# EAGLE design 5v power supply (EAGLE 9.6.2)
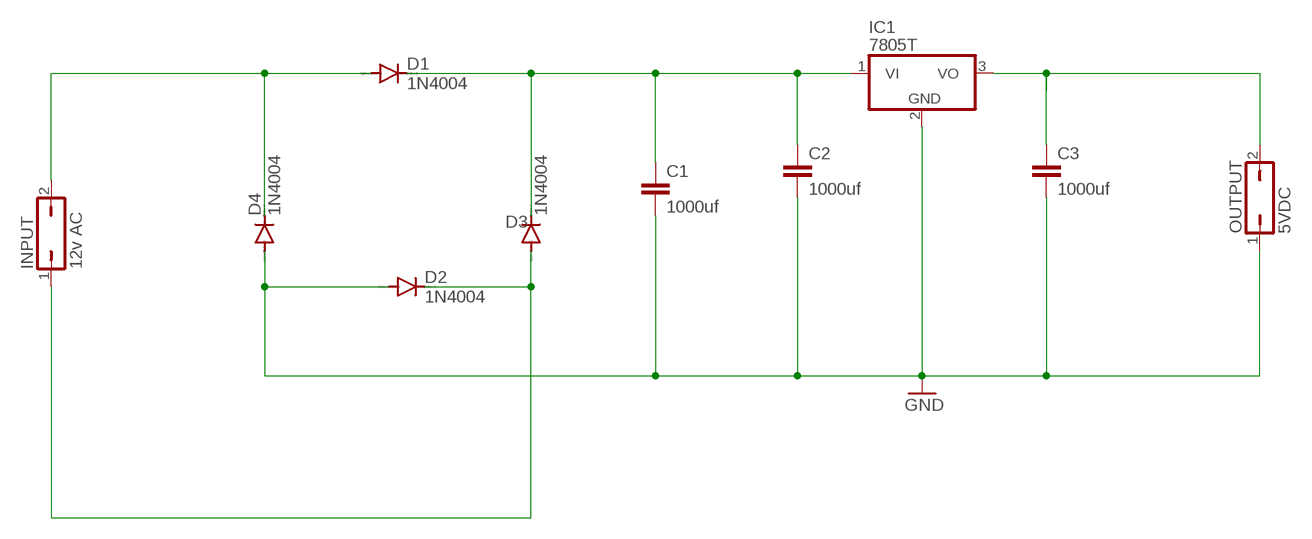
[diagram p0: schematic, sheet 1]

## Parts
C1  1000uf  C2,5-3  [C2.5-3]
C2  1000uf  C2,5-3  [C2.5-3]
C3  1000uf  C2,5-3  [C2.5-3]
D1  1N4004  [DO41-10]
D2  1N4004  [DO41-10]
D3  1N4004  [DO41-10]
D4  1N4004  [DO41-10]
IC1  7805T  [TO220H]
INPUT  12v AC  JP1Q  [JP1]
OUTPUT  5VDC  JP1Q  [JP1]

## Nets
GND: C1.2 C2.2 C3.2 D2.A D4.A IC1.2(GND) OUTPUT.1
N$1: D1.A D4.C INPUT.2
N$2: C1.1 C2.1 D1.C D3.C IC1.1(VI)
N$3: C3.1 IC1.3(VO) OUTPUT.2
N$4: D2.C D3.A INPUT.1

## Library data of the parts
C1-C3 = capacitor-wima:C: CAPACITOR naming: grid - package width
D1-D4 = diode:1N4004: DIODE general purpose rectifier, 1 A
IC1 = linear:78*: Positive VOLTAGE REGULATOR Source: http://cache.national.com/ds/LM/LM78L05.pdf http://www.fairchildsemi.com/ds/LM/LM7805.pdf
INPUT OUTPUT = jumper:JP1Q: JUMPER

## Board
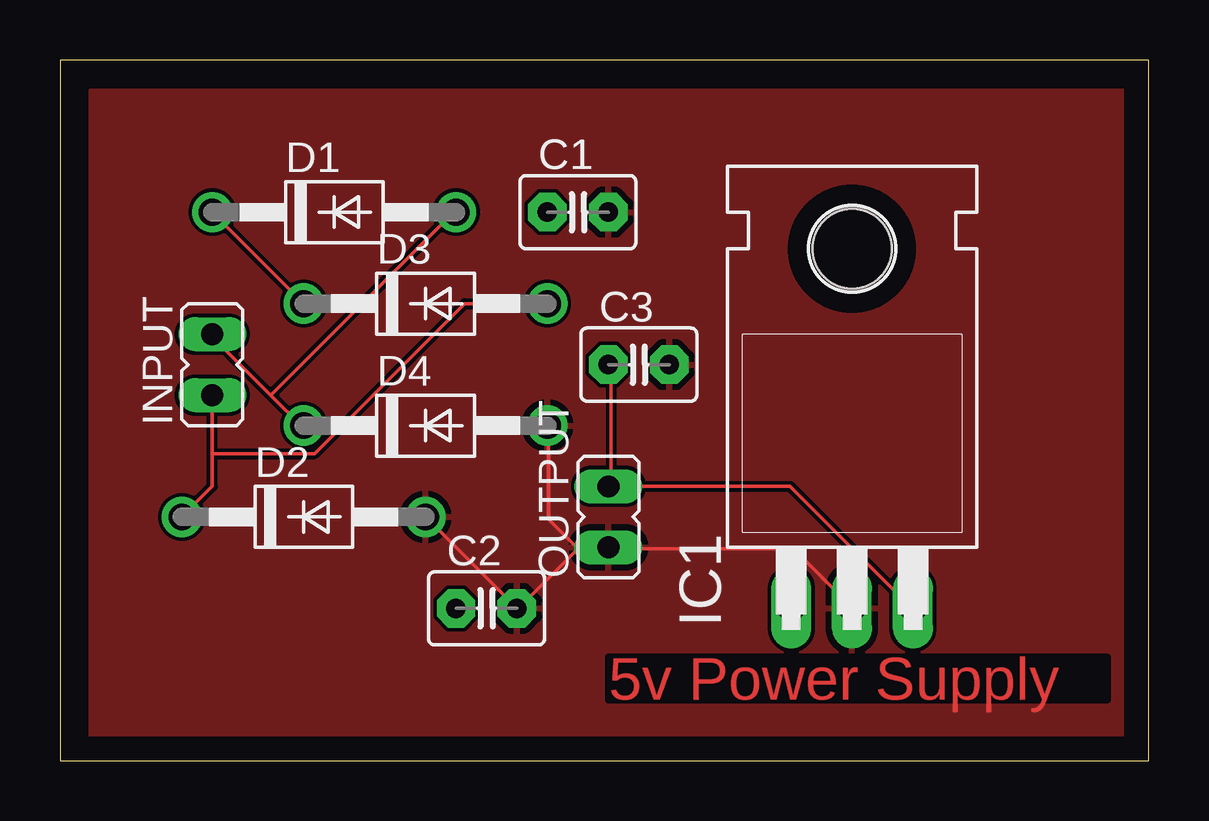
[diagram p1: board, top side]
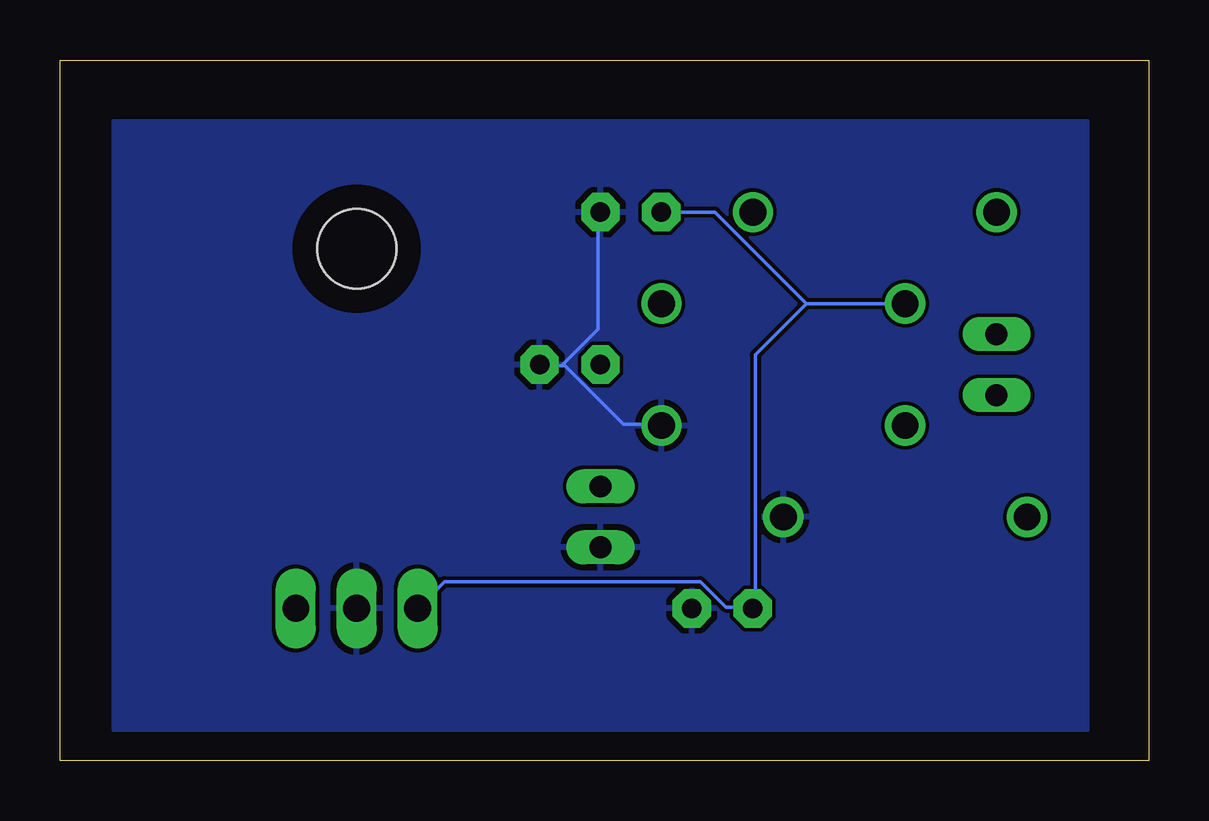
[diagram p2: board, bottom side, seen from below]

Size 45.39 x 29.2 mm. Coordinates in mm from the lower left corner, seen from the top.
Outline: 0,0 45.39,0 45.39,29.2 0,29.2 0,0
Copper layers (1*16): Top 0.035mm / dielectric 1.5mm / Bottom 0.035mm
Design rules "default": minimum track width 6mil, minimum drill 0.35mm, track to track 6mil, track to pad 6mil, pad to pad 6mil, via to via 6mil, smd to smd 6mil, copper to edge 40mil, drill to drill 6mil, minimum pad ring 10mil, minimum via ring 8mil, stop-mask expansion 4mil, vias tented up to drill 0mil, thermal gap 10mil

### Footprints (pad centres in the part's own frame; a part is rotated, then mirrored left to right if it is on the bottom)
C2.5-3 = drill 0.813 pad 1.6 octagon: 1 -1.27,0; 2 1.27,0
DO41-10 = drill 1.118: A 5.08,0; C -5.08,0
TO220H = drill 1.118 long: 1 -2.54,-10.16; 2 0,-10.16; 3 2.54,-10.16 | hole 3.302: 0,4.826
JP1 = drill 0.914 long: 1 0,-1.27; 2 0,1.27

### Placement (x,y rotation side)
C1  21.59,22.86 0 top
C2  17.78,6.35 0 top
C3  24.13,16.51 0 top
D1  11.43,22.86 0 top
D2  10.16,10.16 0 top
D3  15.24,19.05 0 top
D4  15.24,13.97 0 top
IC1  33.02,16.51 0 top
INPUT  6.35,16.51 0 top
OUTPUT  22.86,10.16 0 top

### Tracks (layer width: path | path; a pad name or v marks a point on that pad's centre or on a via)
GND
  Top 0.152: 21.59,8.84 22.81,8.84 OUTPUT.1 | 21.59,8.84 19.15,6.4 C2.2 D2.A | IC1.2 33.02,6.4 30.58,8.84 22.96,8.84 OUTPUT.1 | 21.59,8.84 20.37,10.06 20.37,13.87 D4.A | 21.59,8.84 OUTPUT.1
  Bottom 0.152: 24.49,16.46 24.33,16.46 21.9,14.02 20.37,14.02 D4.A | 24.49,16.46 25.4,16.46 C3.2 | 24.49,16.46 22.96,17.98 22.96,22.86 C1.2
  pour Bottom: 2.54,26.67 41.91,26.67 43.18,26.67 43.18,1.27 2.54,1.27 2.54,3.81
  pour Top: 1.27,27.94 44.45,27.94 44.45,0 1.27,0
N$1
  Top 0.152: 8.79,15.24 10.16,13.87 D4.C | 8.79,15.24 6.35,17.68 INPUT.2 | 8.79,15.24 16.41,22.86 D1.A
N$2
  Top 0.152: D3.C D1.C
  Bottom 0.152: IC1.1 29.36,7.47 18.69,7.47 17.63,6.4 16.56,6.4 C2.1 16.41,6.4 16.41,16.92 14.28,19.05 | C1.1 18.09,22.86 14.28,19.05 | D3.C 14.28,19.05
N$3
  Top 0.152: 22.96,11.43 22.96,16.46 C3.1 | 22.96,11.43 30.43,11.43 35.46,6.4 IC1.3 | 22.96,11.43 OUTPUT.2
N$4
  Top 0.152: 6.35,12.8 6.35,11.43 D2.C | 6.35,12.8 INPUT.1 | D3.A 16.87,19.05 10.62,12.8 6.35,12.8

### Text on the board
Top: 5v Power Supply